# EAGLE design YOTSUBA_+X_EM_ver.2.0 (EAGLE 9.6.2)
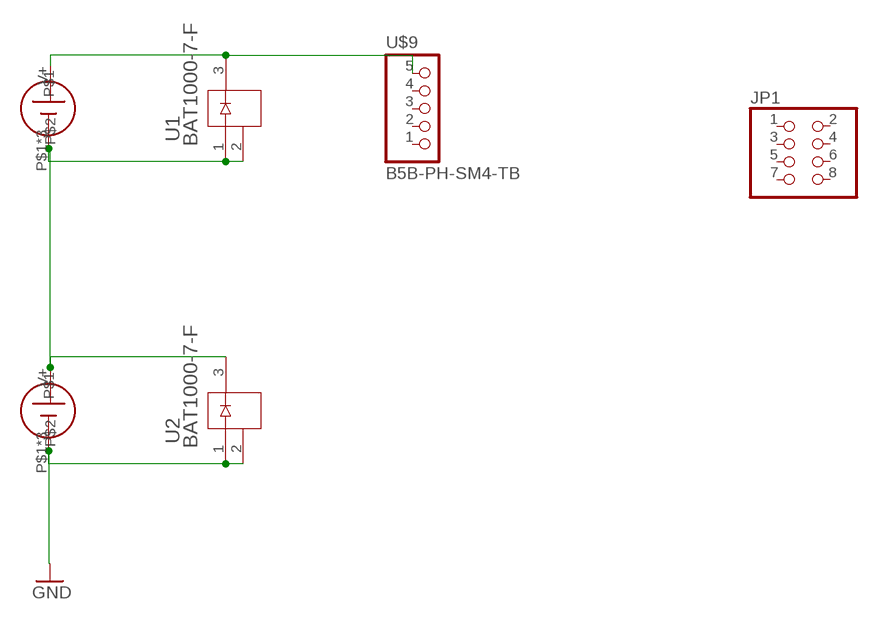
[diagram p0: schematic, sheet 1]

## Parts
JP1  PINHD-2X4  [2X04]
U1  BAT1000-7-F  [SOT23_BAT_DIO]
U2  BAT1000-7-F  [SOT23_BAT_DIO]
U$1  SOLAR_2.0_SOLAR  [SOLAR_2.0_SOLAR]
U$8  SOLAR_2.0_SOLAR  [SOLAR_2.0_SOLAR]
U$9  B5B-PH-SM4-TB  [B5B-PH-SM4-TB]

## Nets
GND: U2.1 U2.2 U$8.P$1 U$8.P$2 U$8.P$3
N$5: U1.1 U1.2 U2.3 U$1.P$1 U$1.P$2 U$1.P$3 U$8.V+
N$6: U1.3 U$1.V+ U$9.5
Unconnected: JP1.1 JP1.2 JP1.3 JP1.4 JP1.5 JP1.6 JP1.7 JP1.8 U$9.1 U$9.2 U$9.3 U$9.4

## Library data of the parts
JP1 = pinhead:PINHD-2X4: PIN HEADER
U1 U2 = BAT1000:BAT1000-7-F; COPYRIGHT: Copyright (C) 2022 Ultra Librarian. All rights reserved.; MANUFACTURER_PART_NUMBER: BAT1000-7-F; MFR_NAME: Diodes Inc
U$1 U$8 = BBM_panel_base+Z ver1.0:SOLAR_2.0_SOLAR
U$9 = MITSUBA_Connectors-v4.0:B5B-PH-SM4-TB

## Board
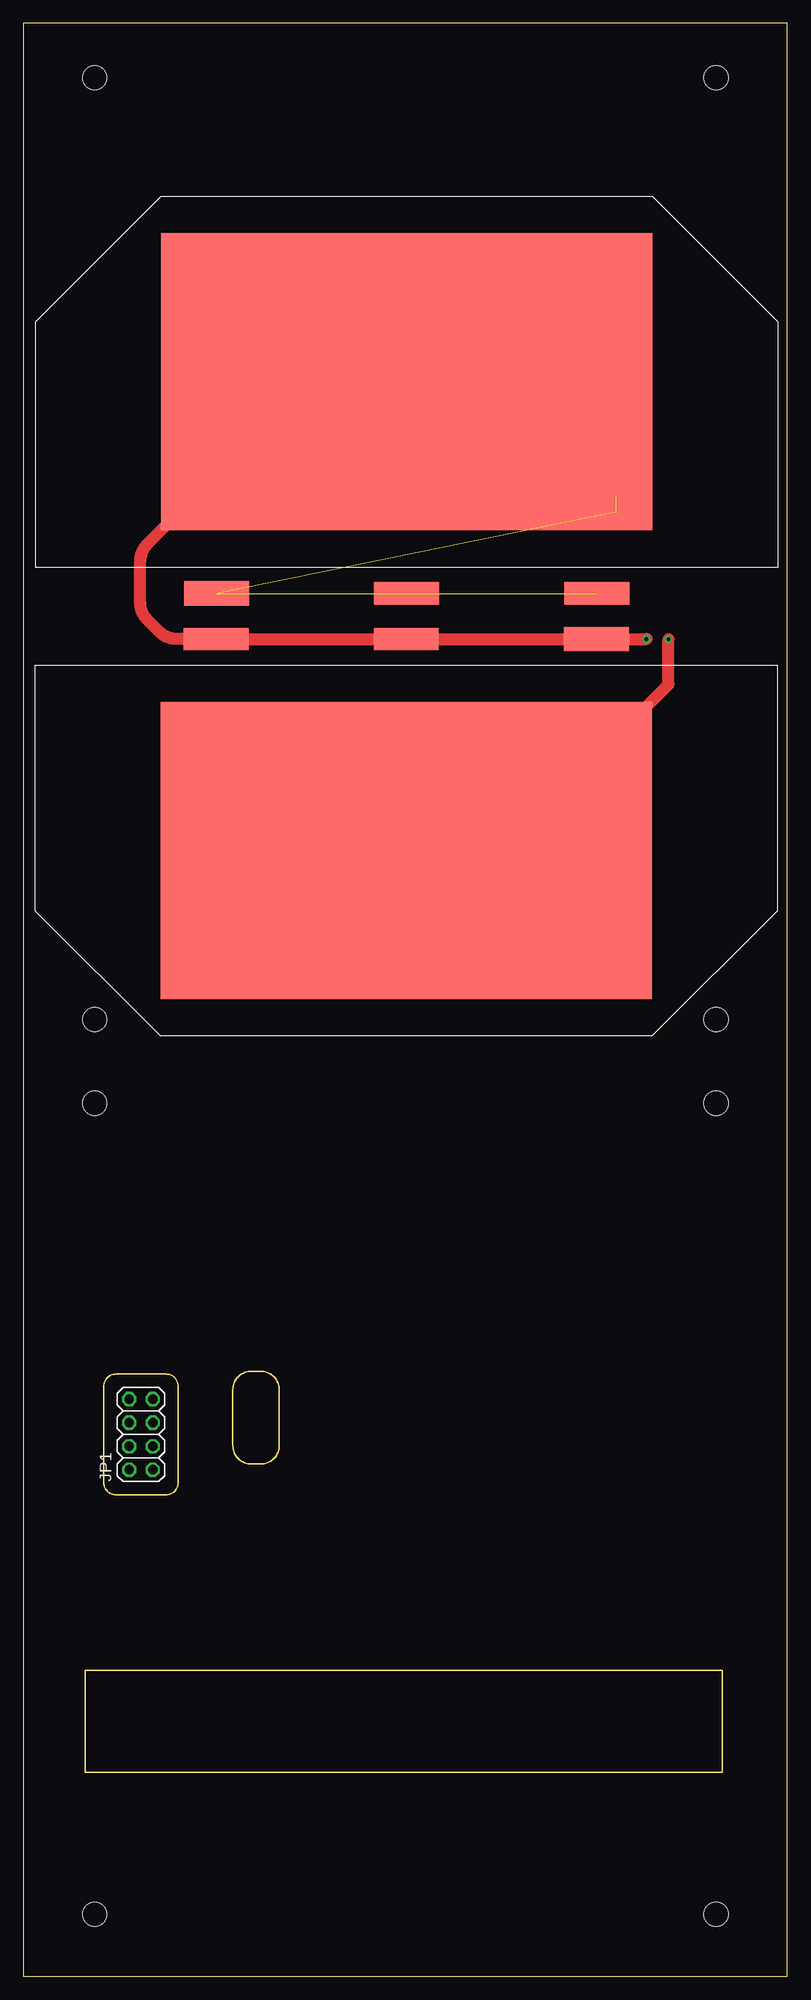
[diagram p1: board, top side]
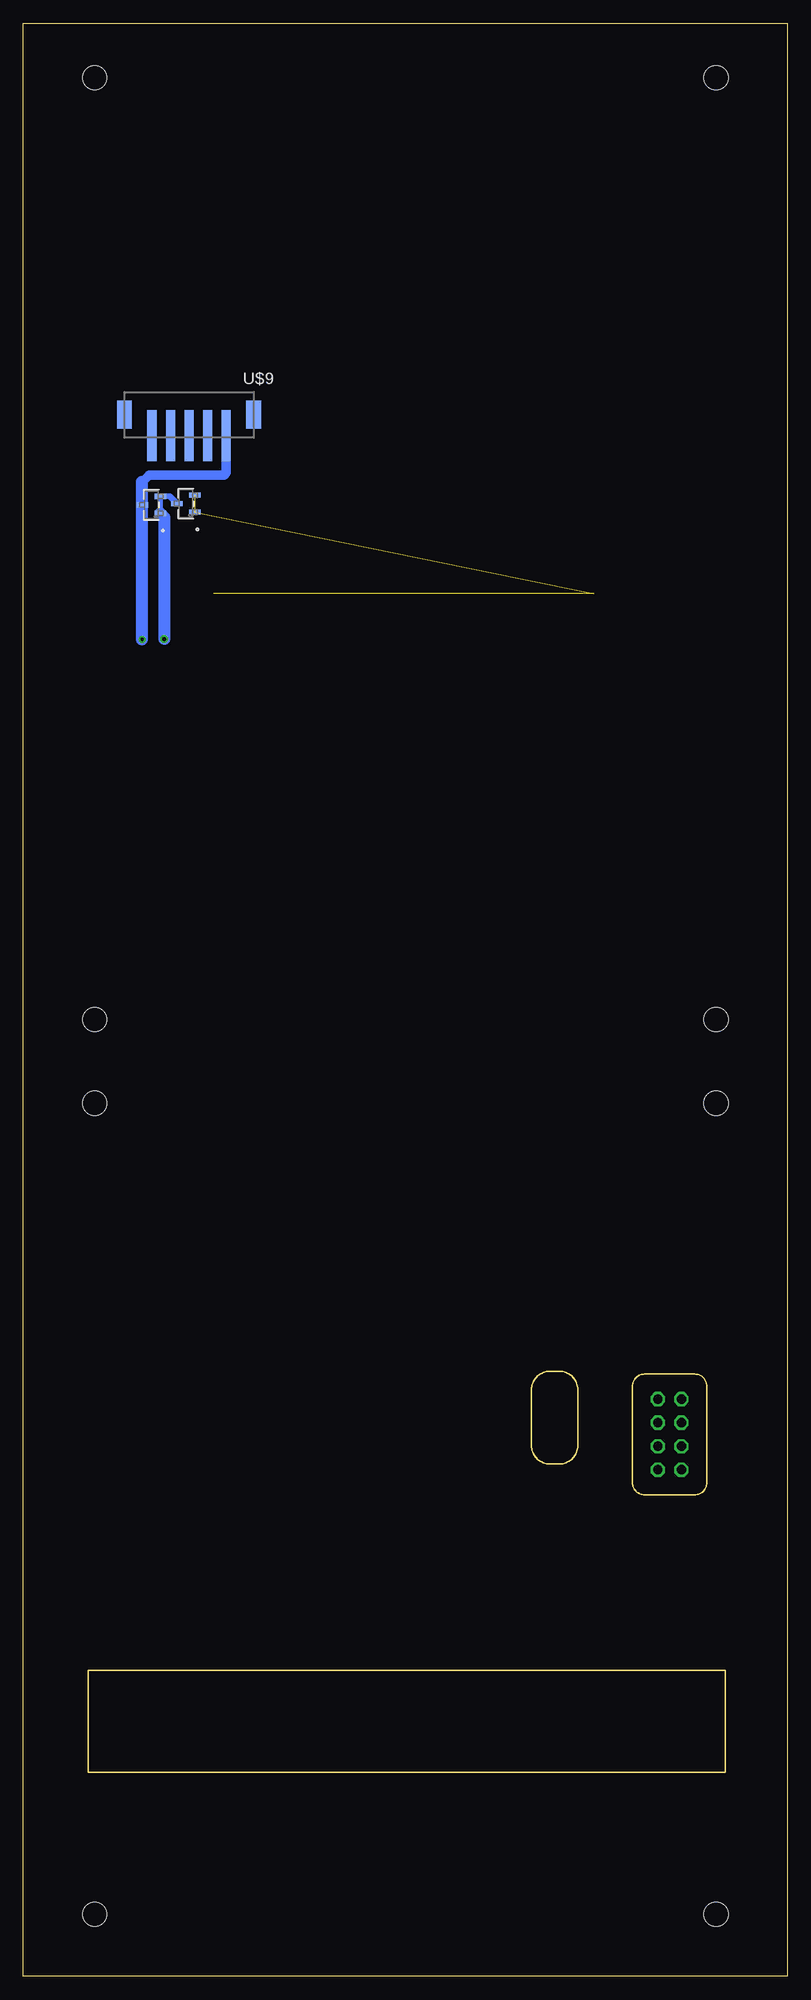
[diagram p2: board, bottom side, seen from below]

Size 82.4 x 210.5 mm. Coordinates in mm from the lower left corner, seen from the top.
Outline: 0,0 82.4,0 82.4,210.5 0,210.5 0,0
Outline: 6.7,22 75.4,22 75.4,33 6.7,33 6.7,22
Outline: 8.7,63.63 8.7,53.17 arc90 9.97,51.9 15.43,51.9 arc90 16.7,53.17 16.7,63.63 arc90 15.43,64.9 9.97,64.9 arc90 8.7,63.63
Outline: 27.6,63.21 27.6,57.21 arc-90 25.6,55.21 24.6,55.21 arc-90 22.6,57.21 22.6,63.21 arc-90 24.6,65.21 25.6,65.21 arc-90 27.6,63.21
Copper layers (1*16): Top 0.035mm / dielectric 1.5mm / Bottom 0.035mm
Design rules "default": minimum track width 6mil, minimum drill 0.35mm, track to track 6mil, track to pad 6mil, pad to pad 6mil, via to via 6mil, smd to smd 6mil, copper to edge 40mil, drill to drill 6mil, minimum pad ring 10mil, minimum via ring 8mil, stop-mask expansion 4mil, vias tented up to drill 0mil, thermal gap 10mil
Holes 2.6 mm at 7.7,6.7 74.7,6.7 7.7,204.6 74.7,204.6 74.7,103.1 7.7,94.1 74.7,94.1 7.7,103.1

### Footprints (pad centres in the part's own frame; a part is rotated, then mirrored left to right if it is on the bottom)
2X04 = drill 1.016 octagon: 1 -3.81,-1.27; 2 -3.81,1.27; 3 -1.27,-1.27; 4 -1.27,1.27; 5 1.27,-1.27; 6 1.27,1.27; 7 3.81,-1.27; 8 3.81,1.27
SOT23_BAT_DIO = smd 0.559 x 1.27: 1 -0.915,-0.965; 2 0.915,-0.965; 3 0,0.965
SOLAR_2.0_SOLAR = smd 7 x 2.6: P$1 6,-42.8 | smd 7 x 2.4: P$2 26.5,-42.8; P$3 47,-42.8 | smd 53 x 32: V+ 26.5,-20
B5B-PH-SM4-TB = smd 1 x 5.5: 1 0,0; 2 2,0; 3 4,0; 4 6,0; 5 8,0 | smd 1.6 x 3: MP1 -2.983,2.25; MP2 10.959,2.25

### Placement (x,y rotation side)
JP1  12.7,58.4 90 top
U1  68.58,158.59 90 bottom
U2  64.86,158.71 90 bottom
U$1  67.8,101.33 180 top
U$8  14.85,191.85 0 top
U$9  68.51,166.07 0 bottom

### Tracks (layer width: path | path; a pad name or v marks a point on that pad's centre or on a via)
GND  (4 unrouted)
N$5  (via drill 0.45)
  Top 1.27: U$8.V+ 30.87,171.85 13.36,154.34 arc45 12.62,152.55 12.62,148.04 arc45 13.36,146.25 14.74,144.87 arc45 16.53,144.13 U$1.P$3 U$1.P$2 U$1.P$1 v67.2,144.13
  Bottom 0.61: U1.1 U1.2 66.62,159.5 U2.3
  Bottom 1.27: v67.2,144.13 v67.19,144.14 67.19,157.25 U1.1
N$6  (via drill 0.35)
  Top 1.27: U$1.V+ 51.67,121.33 69.58,139.24 v69.58,144.09
  Bottom 1.016: 69.58,161.05 68.83,161.8 60.75,161.8 60.51,162.04 U$9.5
  Bottom 1.27: 69.58,161.05 69.58,158.62 U1.3 69.58,158.56 v69.58,144.09